# Altium schematic sheet MSP430_ControlBoard.SchDoc
size A4
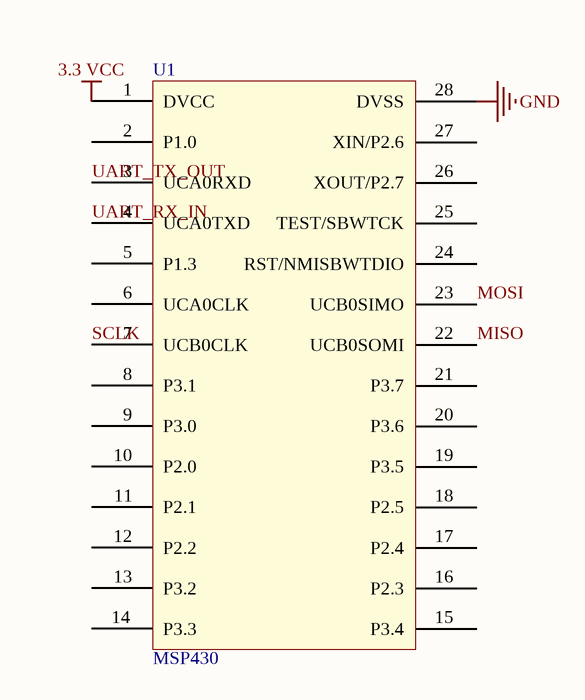
[diagram p0: MSP430_ControlBoard.SchDoc]

## Parts
U1  MSP430  [28TSSOP]

## Nets
3.3 VCC: U1.1(DVCC)
GND: U1.28(DVSS)
MISO: U1.22(UCB0SOMI)
MOSI: U1.23(UCB0SIMO)
SCLK: U1.7(UCB0CLK)
UART_RX_IN: U1.4(UCA0TXD)
UART_TX_OUT: U1.3(UCA0RXD)

Not connected (* = marked no-connect by the designer): U1 2(P1.0) 5(P1.3) 6(UCA0CLK) 8(P3.1) 9(P3.0) 10(P2.0) 11(P2.1) 12(P2.2) 13(P3.2) 14(P3.3) 15(P3.4) 16(P2.3) 17(P2.4) 18(P2.5) 19(P3.5) 20(P3.6) 21(P3.7) 24(RST/NMISBWTDIO) 25(TEST/SBWTCK) 26(XOUT/P2.7) 27(XIN/P2.6)